# Altium schematic sheet ROSV_Arch_Idea2_Layout.SchDoc
size A4; DocumentNumber: 2; Revision: 2; SheetNumber: 2; SheetTotal: 5; DrawnBy: T. Burns; Organization: N/A
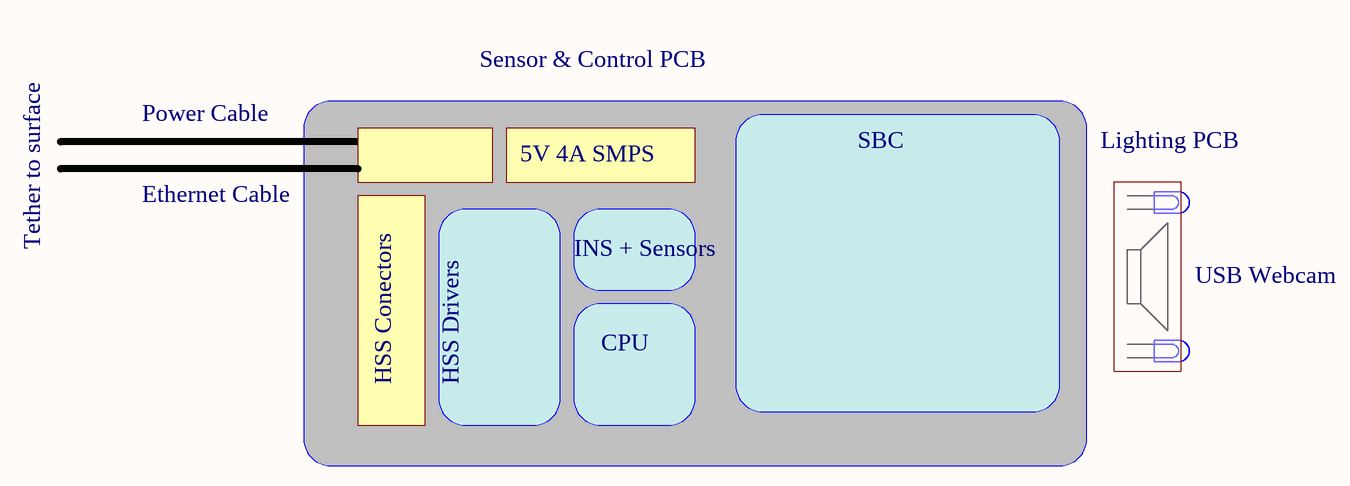
[diagram p0: ROSV_Arch_Idea2_Layout.SchDoc]

## Parts
(Parts that share a designator on the sheet are numbered #1, #2 ... from top to bottom, then left to right.)
DS?#1  Lamp  [PIN2]  (value not drawn)
DS?#2  Lamp  [PIN2]  (value not drawn)

## Nets

Not connected (* = marked no-connect by the designer): DS?#1 1 2; DS?#2 1 2

## Notes on the sheet
- Sensor & Control PCB
- Power Cable
- Ethernet Cable
- 5V 4A SMPS
- SBC
- (near DS?#1) Lighting PCB
- Tether to surface
- INS + Sensors
- USB Webcam
- HSS Conectors
- HSS Drivers
- CPU
- Title
- Size:
- Date:
- A4
- Number:
- Time:
- Revision:
- Sheet
- of
- File:

## Library data of the parts
DS?#1 DS?#2 = Lamp: Incandescent Bulb; Published: 24-Mar-1999; LatestRevisionDate: 17-Jul-2002; LatestRevisionNote: Re-released for DXP Platform.; PackageReference: PIN2; Publisher: Altium Limited